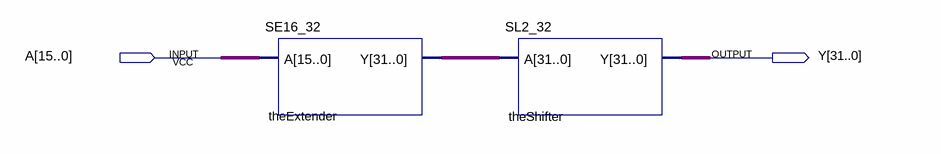
[diagram p0: schematic sheet]
// Quartus schematic SESL16_32.bdf as structural Verilog: 2 symbols, 2 pins
module SESL16_32 (
  input  [15:0] A,
  output [31:0] Y
);

  wire [31:0] theExtender_y;

  SE16_32 theExtender (.A(A), .Y(theExtender_y));
  SL2_32 theShifter (.A(theExtender_y), .Y(Y));
endmodule
